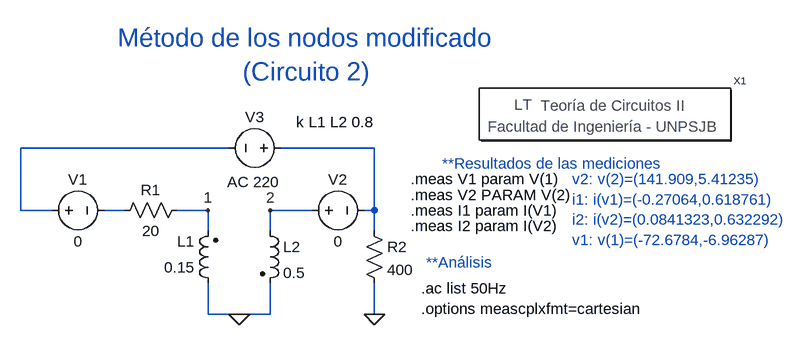
[diagram p0: schematic nodos_modificado2.asc]
nodos_modificado2.asc, the LTspice schematic file:
Version 4
SHEET 1 992 680
WIRE 128 48 -192 48
WIRE 352 48 208 48
WIRE -192 144 -192 48
WIRE -144 144 -192 144
WIRE -32 144 -64 144
WIRE 96 144 48 144
WIRE 256 144 192 144
WIRE 352 144 352 48
WIRE 352 144 336 144
WIRE 96 176 96 144
WIRE 192 176 192 144
WIRE 352 176 352 144
WIRE 96 304 96 256
WIRE 144 304 96 304
WIRE 192 304 192 256
WIRE 192 304 144 304
WIRE 352 304 352 256
FLAG 352 304 0
FLAG 144 304 0
FLAG 96 144 1
FLAG 192 144 2
SYMBOL res 64 128 R90
WINDOW 0 0 56 VBottom 2
WINDOW 3 32 56 VTop 2
SYMATTR InstName R1
SYMATTR Value 20
SYMBOL ind2 112 272 R180
WINDOW 0 36 80 Left 2
WINDOW 3 36 40 Left 2
SYMATTR InstName L1
SYMATTR Value 0.15
SYMATTR Type ind
SYMBOL ind2 176 160 R0
SYMATTR InstName L2
SYMATTR Value 0.5
SYMATTR Type ind
SYMBOL voltage -160 144 R270
WINDOW 0 32 56 VTop 2
WINDOW 3 -32 56 VBottom 2
WINDOW 123 0 0 Left 0
WINDOW 39 0 0 Left 0
SYMATTR InstName V1
SYMATTR Value 0
SYMBOL voltage 240 144 R270
WINDOW 0 32 56 VTop 2
WINDOW 3 -32 56 VBottom 2
WINDOW 123 0 0 Left 0
WINDOW 39 0 0 Left 0
SYMATTR InstName V2
SYMATTR Value 0
SYMBOL res 336 160 R0
SYMATTR InstName R2
SYMATTR Value 400
SYMBOL voltage 224 48 R90
WINDOW 0 -32 56 VBottom 2
WINDOW 3 32 56 VTop 2
WINDOW 123 37 58 VTop 2
WINDOW 39 0 0 Left 0
SYMATTR InstName V3
SYMATTR Value ""
SYMATTR Value2 AC 220
SYMBOL Circuitos2\\Letreros\\Teoría\ de\ Circuitos\ II 704 0 R0
SYMATTR InstName X1
TEXT 232 8 Left 2 !k L1 L2 0.8
TEXT 432 224 Left 2 ;**Análisis
TEXT 424 264 Left 2 !.ac list 50Hz
TEXT 424 296 Left 2 !.options meascplxfmt=cartesian
TEXT 408 120 Left 2 !.meas V2 PARAM V(2)
TEXT 408 144 Left 2 !.meas I1 param I(V1)
TEXT 408 168 Left 2 !.meas I2 param I(V2)
TEXT 248 -96 Center 4 ;Método de los nodos modificado\n(Circuito 2)
TEXT 456 72 Left 2 ;**Resultados de las mediciones
TEXT 408 96 Left 2 !.meas V1 param V(1)
TEXT 656 96 Left 2 ;v2: v(2)=(141.909,5.41235)\ni1: i(v1)=(-0.27064,0.618761)\ni2: i(v2)=(0.0841323,0.632292)\nv1: v(1)=(-72.6784,-6.96287)

The netlist it stands for:
* nodos_modificado2.asc
R1 1 N003 20
L1 0 1 0.15
L2 2 0 0.5
V1 N001 N003 0
V2 2 N002 0
R2 N002 0 400
V3 N002 N001 AC 220
XX1 Teoría de Circuitos II
k L1 L2 0.8
* **Análisis
.ac list 50Hz
.options meascplxfmt=cartesian
.meas V2 PARAM V(2)
.meas I1 param I(V1)
.meas I2 param I(V2)
* Método de los nodos modificado
* (Circuito 2)
* **Resultados de las mediciones
.meas V1 param V(1)
* v2: v(2)=(141.909,5.41235)
* i1: i(v1)=(-0.27064,0.618761)
* i2: i(v2)=(0.0841323,0.632292)
* v1: v(1)=(-72.6784,-6.96287)
.backanno
.end